# EAGLE design MEMS_MIC (EAGLE 9.2.1)
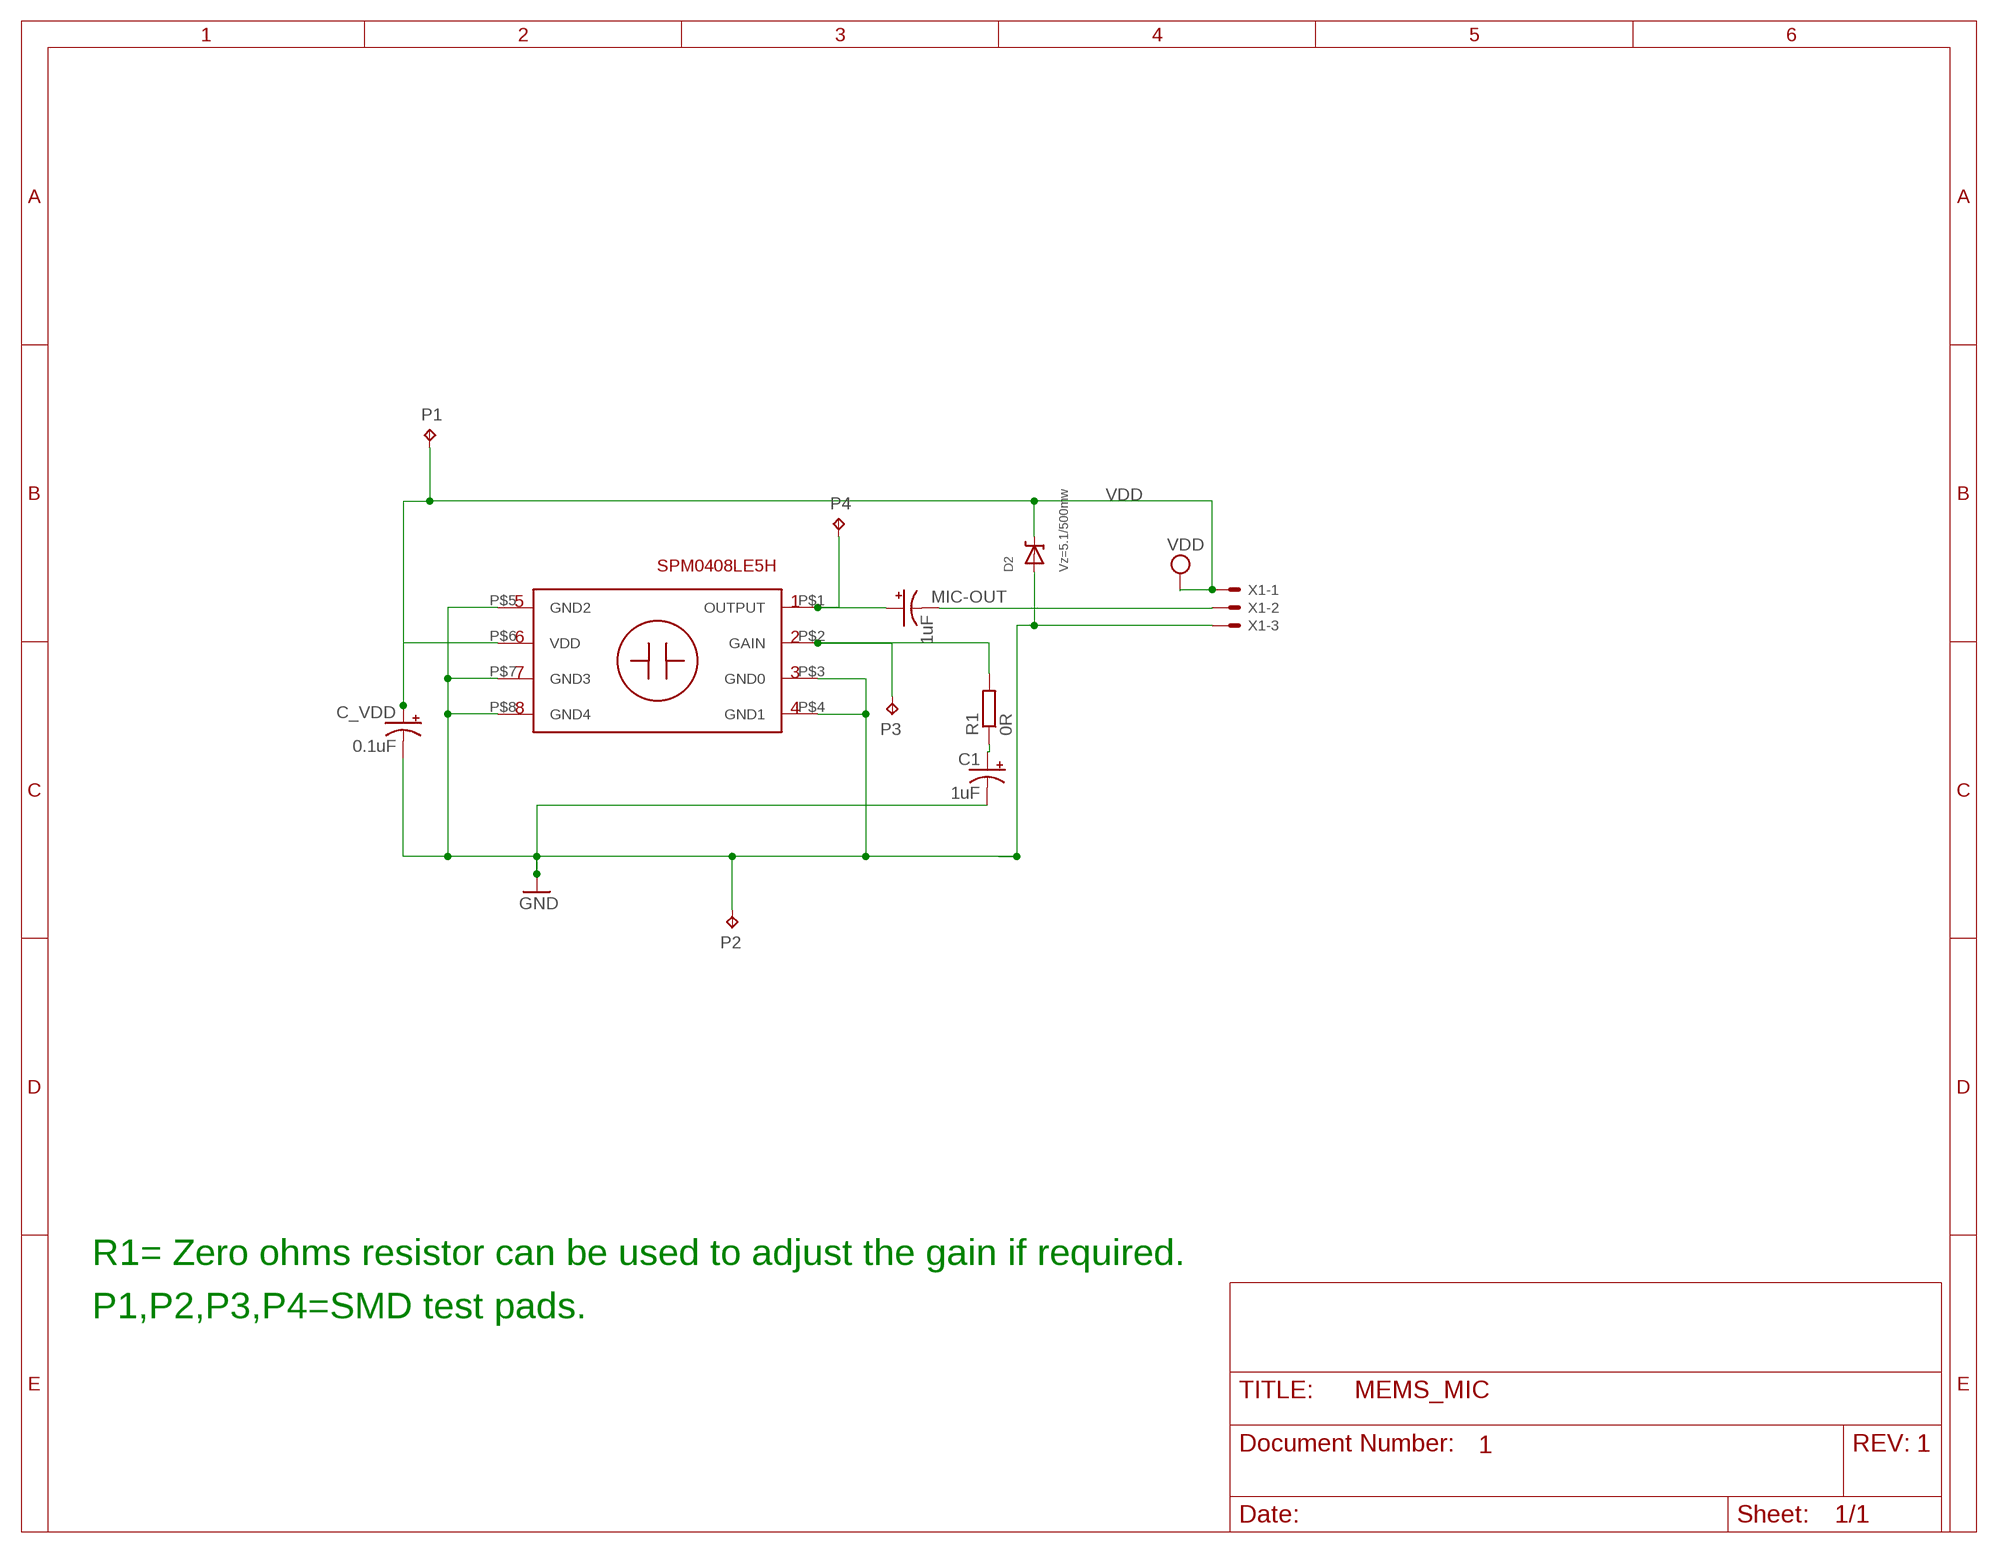
[diagram p0: schematic, sheet 1]

## Parts
C1  1uF  CAP_POL1206-KIT  [EIA3216-KIT]
C_VDD  0.1uF  CAP_POL1206-KIT  [EIA3216-KIT]
D2  Vz=5.1/500mw  DIODE-ZENERSOD123  [SOD-123]
MIC-OUT  1uF  CAP_POL1206-KIT  [EIA3216-KIT]
P1  TPB1,27  [B1,27]
P2  TPB1,27  [B1,27]
P3  TPB1,27  [B1,27]
P4  TPB1,27  [B1,27]
R1  0R  R-EU_R0805  [R0805]
U2  SPM0408LE5H  [SPM0408LE5H-TB]
X1  87438-03  [87438-03]

## Nets
GND: C1.C(-) C_VDD.C(-) D2.A P2.TP U2.P$3(GND0) U2.P$4(GND1) U2.P$5(GND2) U2.P$7(GND3) U2.P$8(GND4) X1.3
MIC_OUT: MIC-OUT.C(-) X1.2
N$1: C1.A(+) R1.1
N$8: MIC-OUT.A(+) P4.TP U2.P$1(OUTPUT)
N$35: P3.TP R1.2 U2.P$2(GAIN)
VDD: C_VDD.A(+) D2.C P1.TP U2.P$6(VDD) X1.1

## Notes on the sheet
- SPM0408LE5H
- R1= Zero ohms resistor can be used to adjust the gain if required.
- P1,P2,P3,P4=SMD test pads.
- 1 | 1

## Library data of the parts
C1 C_VDD MIC-OUT = SparkFun-Passives:CAP_POL: Capacitor Polarized These are standard SMD and PTH capacitors. Normally 10uF, 47uF, and 100uF in electrolytic and tantalum varieties. Always verify the external diameter of the through hole cap, it varies with capacity, voltage, and manufacturer. The EIA devices should be standard.; MF: VISHAY SPRAGUE; MPN: 293D106X96R3A2TE3; OC_FARNELL: 1754143
D2 = microbuilder:DIODE-ZENER: Zener Diode SMA: 30V 1W Zener Diode, 1.2Vf - Digikey: SMAZ30-FDICT-ND
P1-P4 = testpad:TP: Test pad
R1 = resistor:R-EU_: RESISTOR, European symbol
U2 = acousticLib:SPM0408LE5H
X1 = con-molex:87438-03: Wire-to-Board 1.50mm (.059") Pitch Header - Right Angle, SMT, Shrouded Source: http://www.molex.com/product/micro/87438.html; MF: MOLEX; OC_FARNELL: 1711328; OC_NEWARK: unknown

## Net classes
0 default: width 0.152 mm, drill 0.305 mm, clearance 0.152 mm

## Board
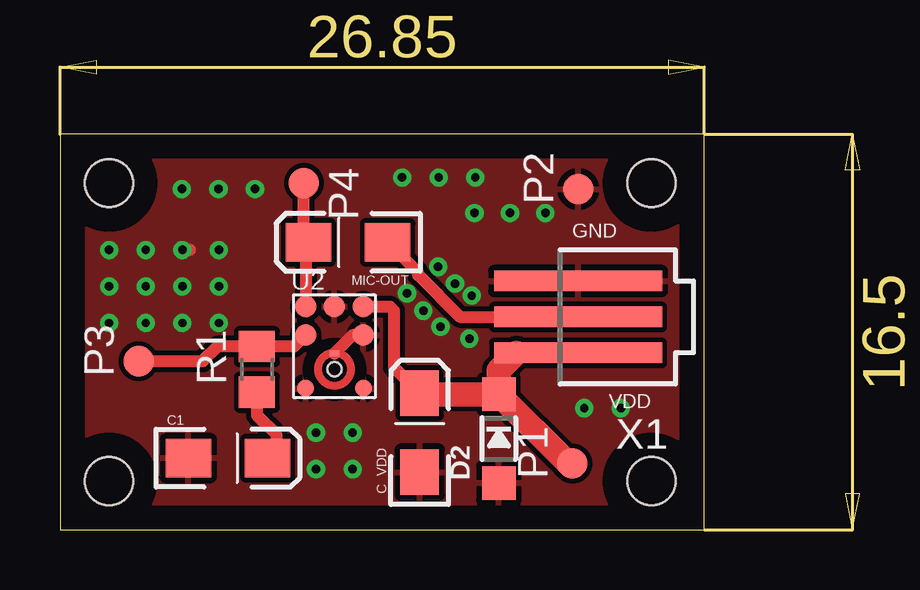
[diagram p1: board, top side]
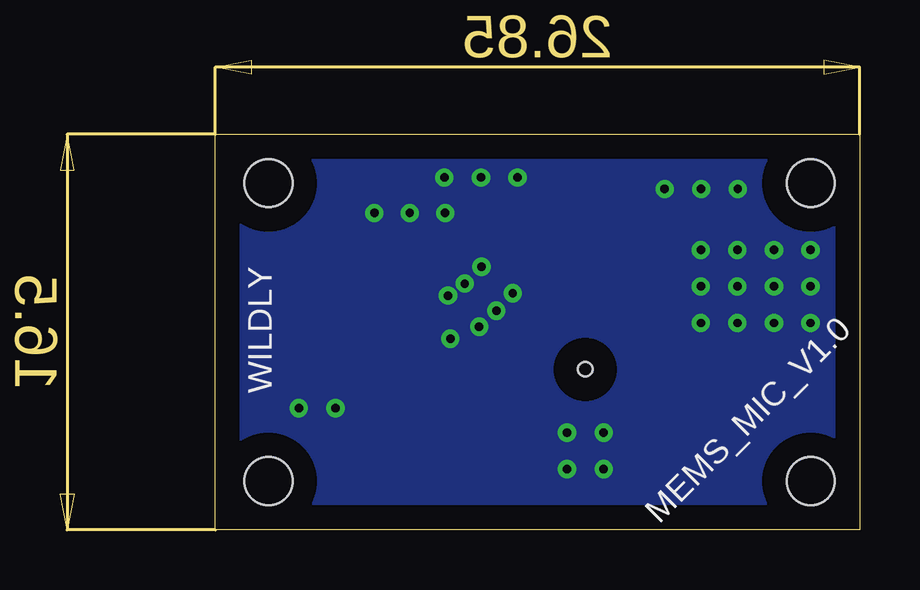
[diagram p2: board, bottom side, seen from below]

Size 26.85 x 16.5 mm. Coordinates in mm from the lower left corner, seen from the top.
Outline: 0,0 26.85,0 26.85,16.5 0,16.5 0,0
Copper layers (1*16): Top 0.035mm / dielectric 1.5mm / Bottom 0.035mm
Design rules "default *": minimum track width 20mil, minimum drill 0.35mm, track to track 8mil, track to pad 8mil, pad to pad 8mil, via to via 8mil, smd to smd 8mil, copper to edge 40mil, drill to drill 6mil, minimum pad ring 10mil, minimum via ring 8mil, stop-mask expansion 4mil, vias tented up to drill 0mil, thermal gap 10mil
Holes 2 mm at 24.64,14.47 24.64,2.04 2.04,14.47 2.04,2.04

### Footprints (pad centres in the part's own frame; a part is rotated, then mirrored left to right if it is on the bottom)
EIA3216-KIT = smd 1.9 x 1.6: A 1.65,0; C -1.65,0
SOD-123 = smd 1.4 x 1.4: A 1.85,0; C -1.85,0
B1,27 = smd 1.27 x 1.27: TP 0,0
R0805 = smd 1.3 x 1.5: 1 -0.95,0; 2 0.95,0
SPM0408LE5H-TB = smd 0.9 x 0.9: P$1 -1.2,1.7; P$2 -1.2,0.506; P$5 1.208,0.506; P$6 1.208,1.7; P$7 0.004,1.7 | smd 0.7 x 0.7: P$3 -1.2,-1.706; P$4 1.208,-1.706 | smd 0.406 x 0.203: P$8 0,-0.26 | hole 0.6: 0.004,-0.916
87438-03 = smd 7 x 0.85: 1 0,1.5; 2 0,0; 3 0,-1.5

### Placement (x,y rotation side)
C1  7,3 0 top
C_VDD  14.99,4.06 90 top
D2  18.29,3.81 270 top
MIC-OUT  12,12 180 top
P1  21.35,2.78 90 top
P2  21.59,14.22 90 top
P3  3.27,7.04 90 top
P4  10.16,14.48 270 top
R1  8.2,6.7 90 top
U2  11.43,7.62 0 top
X1  21.59,8.89 180 top

### Tracks (layer width: path | path; a pad name or v marks a point on that pad's centre or on a via)
GND  (via drill 0.35)
  Top 0.508: U2.P$5 12.2,8.13 U2.P$8 | v5.1,11.68 5.41,11.68
  other vias: 5.1,10.16 5.1,8.64 3.57,11.68 3.57,10.16 3.57,8.64 2.05,11.68 2.05,10.16 2.05,8.64 5.08,14.22 6.6,14.22 8.13,14.22 20.22,13.22 18.75,13.22 17.27,13.22 14.26,14.7 15.78,14.7 17.3,14.7 21.84,5.08 23.37,5.08 10.67,4.06 10.67,2.54 12.19,4.06 12.19,2.54 6.62,11.68 6.62,10.16 6.62,8.64 16.46,10.28 17.16,9.78 15.86,8.48 17.06,7.98 15.76,10.98 14.46,9.88 15.14,9.14
  pour Top: 0,16.51 26.67,16.51 26.67,0 0,0
  pour Bottom: 0,16.51 26.67,16.51 26.67,0 0,0
MIC_OUT
  Top 0.508: MIC-OUT.C 14.92,10.73 14.92,10.63 16.66,8.89 X1.2
N$1
  Top 0.508: R1.1 8.2,4.8 9,4 9,3.35 C1.A
N$8
  Top 0.508: U2.P$1 10.23,11.88 MIC-OUT.A 10.16,12.19 P4.TP
N$35
  Top 0.508: P3.TP 5.96,7.04 6.57,7.65 R1.2 9.75,7.65 U2.P$2
VDD
  Top 0.508: 15.04,5.66 C_VDD.A 13.91,6.79 13.91,9.15 13.74,9.32 U2.P$6 | 21.17,2.78 P1.TP | X1.1 19.02,7.39
  Top 1.016: 19.02,7.39 18.29,6.66 D2.C | D2.C 15.04,5.66 | D2.C 21.17,2.78

### Text on the board
tPlace: GND | VDD
bNames: WILDLY | MEMS_MIC_V1.0